# EAGLE design TP18mm (EAGLE 9.2.2)
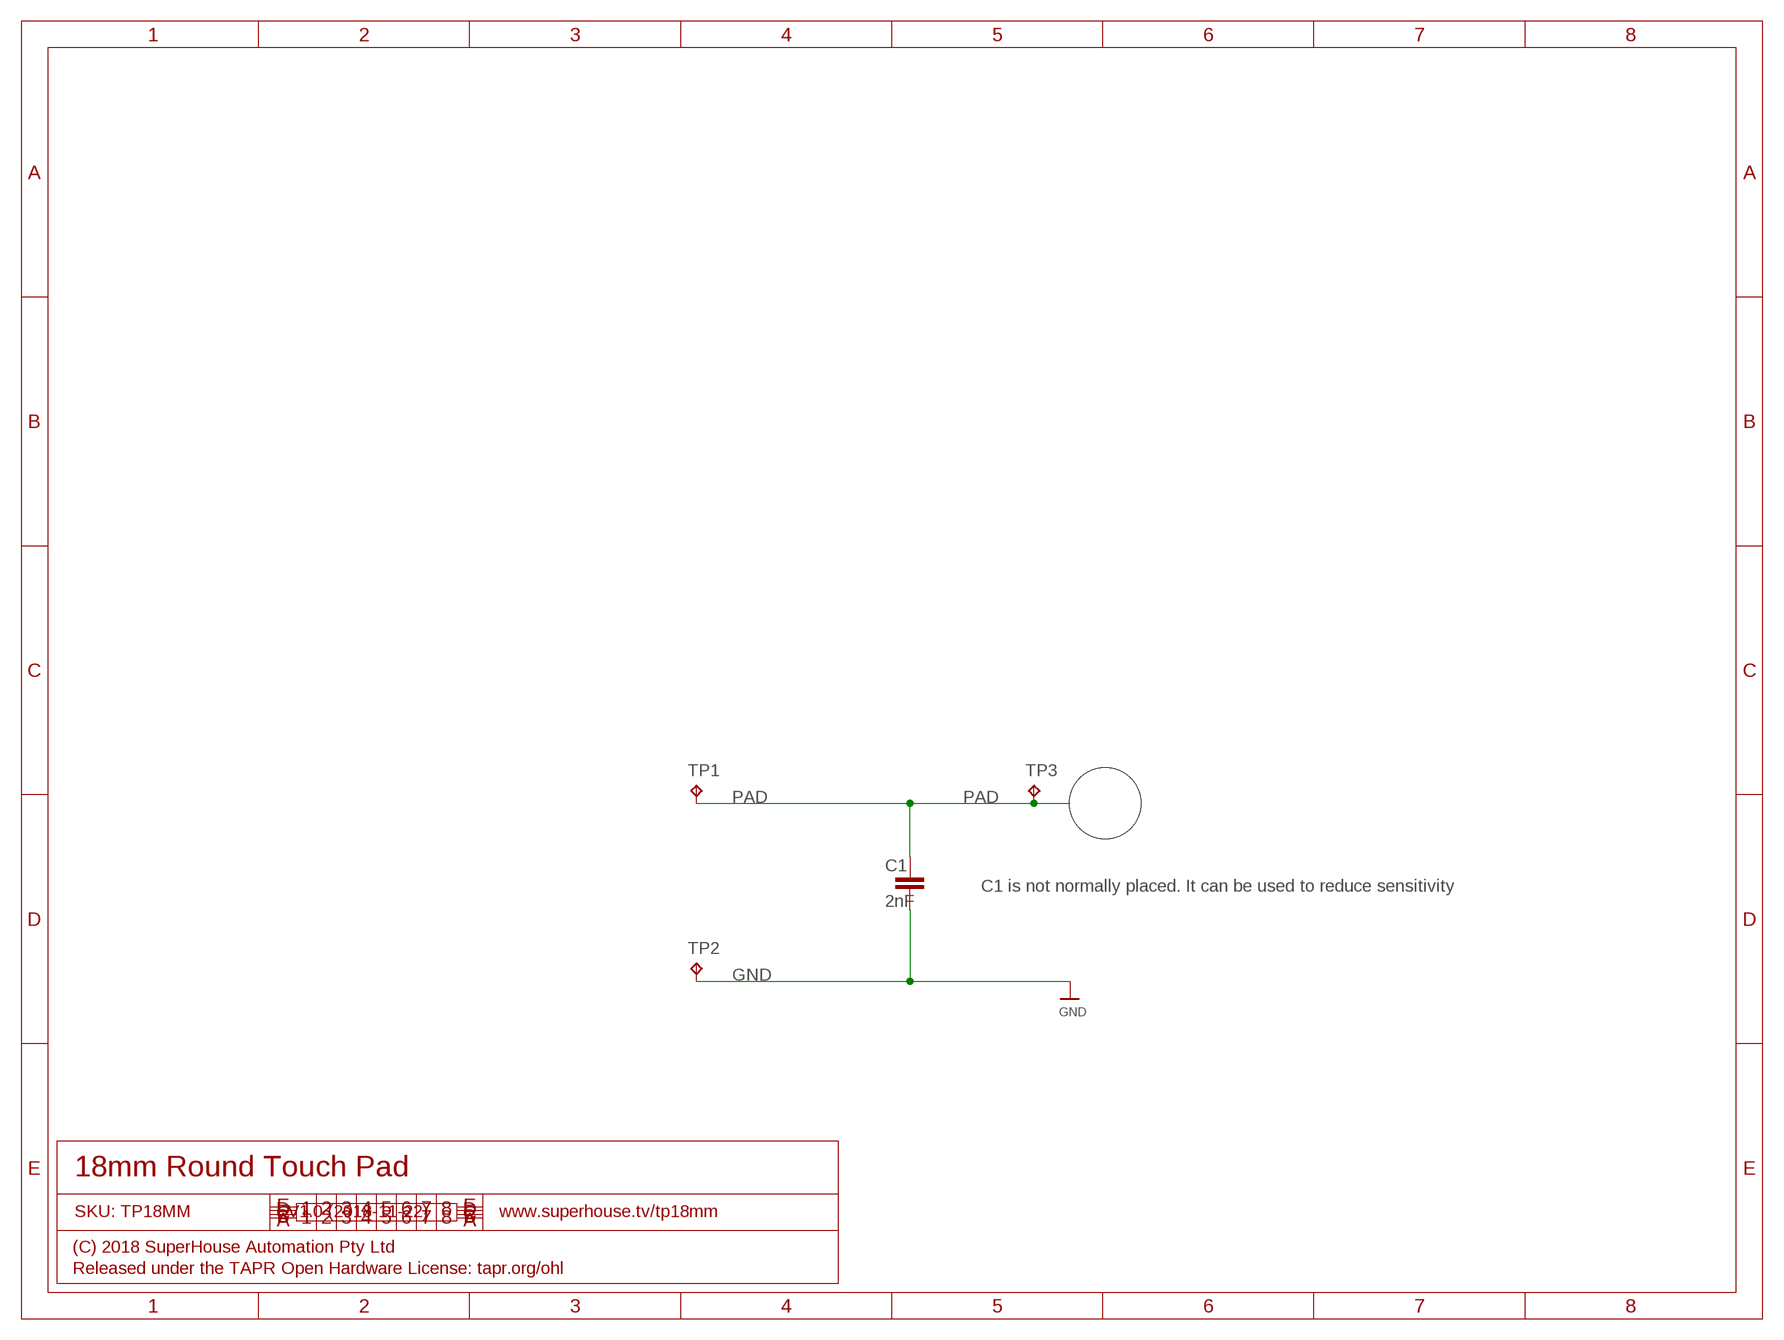
[diagram p0: schematic, sheet 1]

## Parts
C1  2nF  CAP0603  [0603]
TP1  TPB2,54  [B2,54]
TP2  TPB2,54  [B2,54]
TP3  TPB2,54  [B2,54]

## Nets
GND: C1.2 TP2.TP
PAD: C1.1 TP1.TP TP3.TP

## Notes on the sheet
- C1 is not normally placed. It can be used to reduce sensitivity
- 18mm Round Touch Pad
- SKU: TP18MM | V1.0 (2018-11-22) | www.superhouse.tv/tp18mm
- (C) 2018 SuperHouse Automation Pty Ltd
- Released under the TAPR Open Hardware License: tapr.org/ohl

## Library data of the parts
C1 = freetronics-jon:CAP: Capacitor Standard 0603 ceramic capacitor, and 0.1" leaded capacitor.
TP1-TP3 = testpad:TP: Test pad

## Board
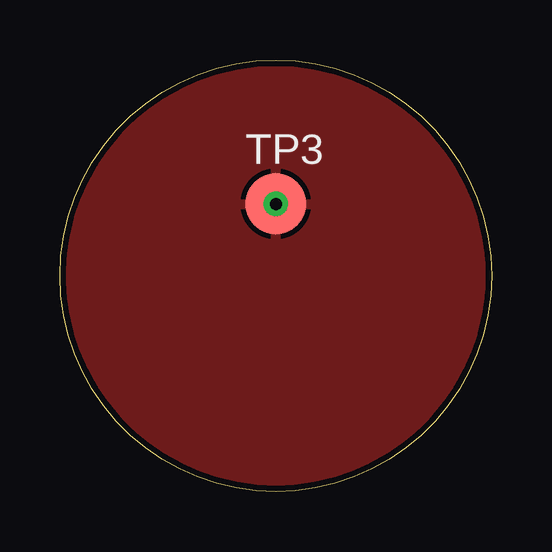
[diagram p1: board, top side]
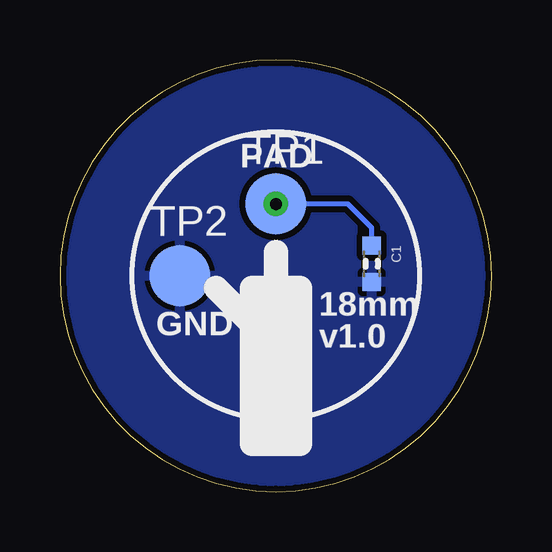
[diagram p2: board, bottom side, seen from below]

Size 18 x 18 mm. Coordinates in mm from the lower left corner, seen from the top.
Outline: 0,9 arc-90 9,18 arc-90 18,9 arc-90 9,0 arc-90 0,9
Copper layers (1*16): Top 0.035mm / dielectric 1.5mm / Bottom 0.035mm
Design rules "default *": minimum track width 8mil, minimum drill 0.4mm, track to track 8mil, track to pad 8mil, pad to pad 8mil, via to via 8mil, smd to smd 8mil, copper to edge 10mil, drill to drill 8mil, minimum pad ring 8mil, minimum via ring 10mil, stop-mask expansion 3mil, vias tented up to drill 25mil, thermal gap 8mil

### Footprints (pad centres in the part's own frame; a part is rotated, then mirrored left to right if it is on the bottom)
0603 = smd 0.762 x 0.762: 1 -0.762,0; 2 0.762,0
B2,54 = smd 2.54 x 2.54: TP 0,0

### Placement (x,y rotation side)
C1  5,9.5 270 bottom
TP1  9,12 0 bottom
TP2  13,9 0 bottom
TP3  9,12 0 top

### Tracks (layer width: path | path; a pad name or v marks a point on that pad's centre or on a via)
GND
  pour Bottom (isolate 0.254): 9,18 arc-90 18,9 arc-90 9,0 arc-90 0,9 arc-90
PAD  (via drill 0.5)
  Bottom 0.203: C1.1 5,11 6,12 TP3.TP
  other vias: 9,12
  pour Top (isolate 0.254): 9,18 arc-90 18,9 arc-90 9,0 arc-90 0,9 arc-90

### Text on the board
bPlace: PAD | 18mm / v1.0 | GND